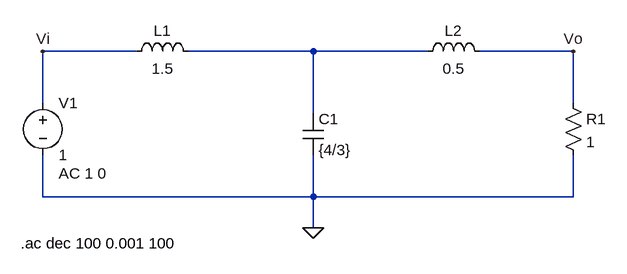
[diagram p0: schematic TS6_2.asc]
TS6_2.asc, the LTspice schematic file:
Version 4
SHEET 1 984 680
WIRE 256 16 112 16
WIRE 528 16 336 16
WIRE 704 16 528 16
WIRE 928 16 784 16
WIRE 112 96 112 16
WIRE 928 96 928 16
WIRE 528 112 528 16
WIRE 112 240 112 176
WIRE 528 240 528 176
WIRE 528 240 112 240
WIRE 928 240 928 176
WIRE 928 240 528 240
WIRE 528 288 528 240
FLAG 528 288 0
FLAG 112 16 Vi
FLAG 928 16 Vo
SYMBOL voltage 112 80 R0
WINDOW 123 24 124 Left 2
WINDOW 39 0 0 Left 0
SYMATTR InstName V1
SYMATTR Value 1
SYMATTR Value2 AC 1 0
SYMBOL ind 240 32 R270
WINDOW 0 32 56 VTop 2
WINDOW 3 5 56 VBottom 2
SYMATTR InstName L1
SYMATTR Value 1.5
SYMBOL ind 688 32 R270
WINDOW 0 32 56 VTop 2
WINDOW 3 5 56 VBottom 2
SYMATTR InstName L2
SYMATTR Value 0.5
SYMBOL cap 512 112 R0
SYMATTR InstName C1
SYMATTR Value {4/3}
SYMBOL res 912 80 R0
SYMATTR InstName R1
SYMATTR Value 1
TEXT 78 312 Left 2 !.ac dec 100 0.001 100

The netlist it stands for:
* TS6_2.asc
V1 Vi 0 1 AC 1 0
L1 Vi N001 1.5
L2 N001 Vo 0.5
C1 N001 0 {4/3}
R1 Vo 0 1
.ac dec 100 0.001 100
.backanno
.end